# Altium schematic sheet 03_PWR.SchDoc
size A3; SheetNumber: 2; SheetTotal: 16
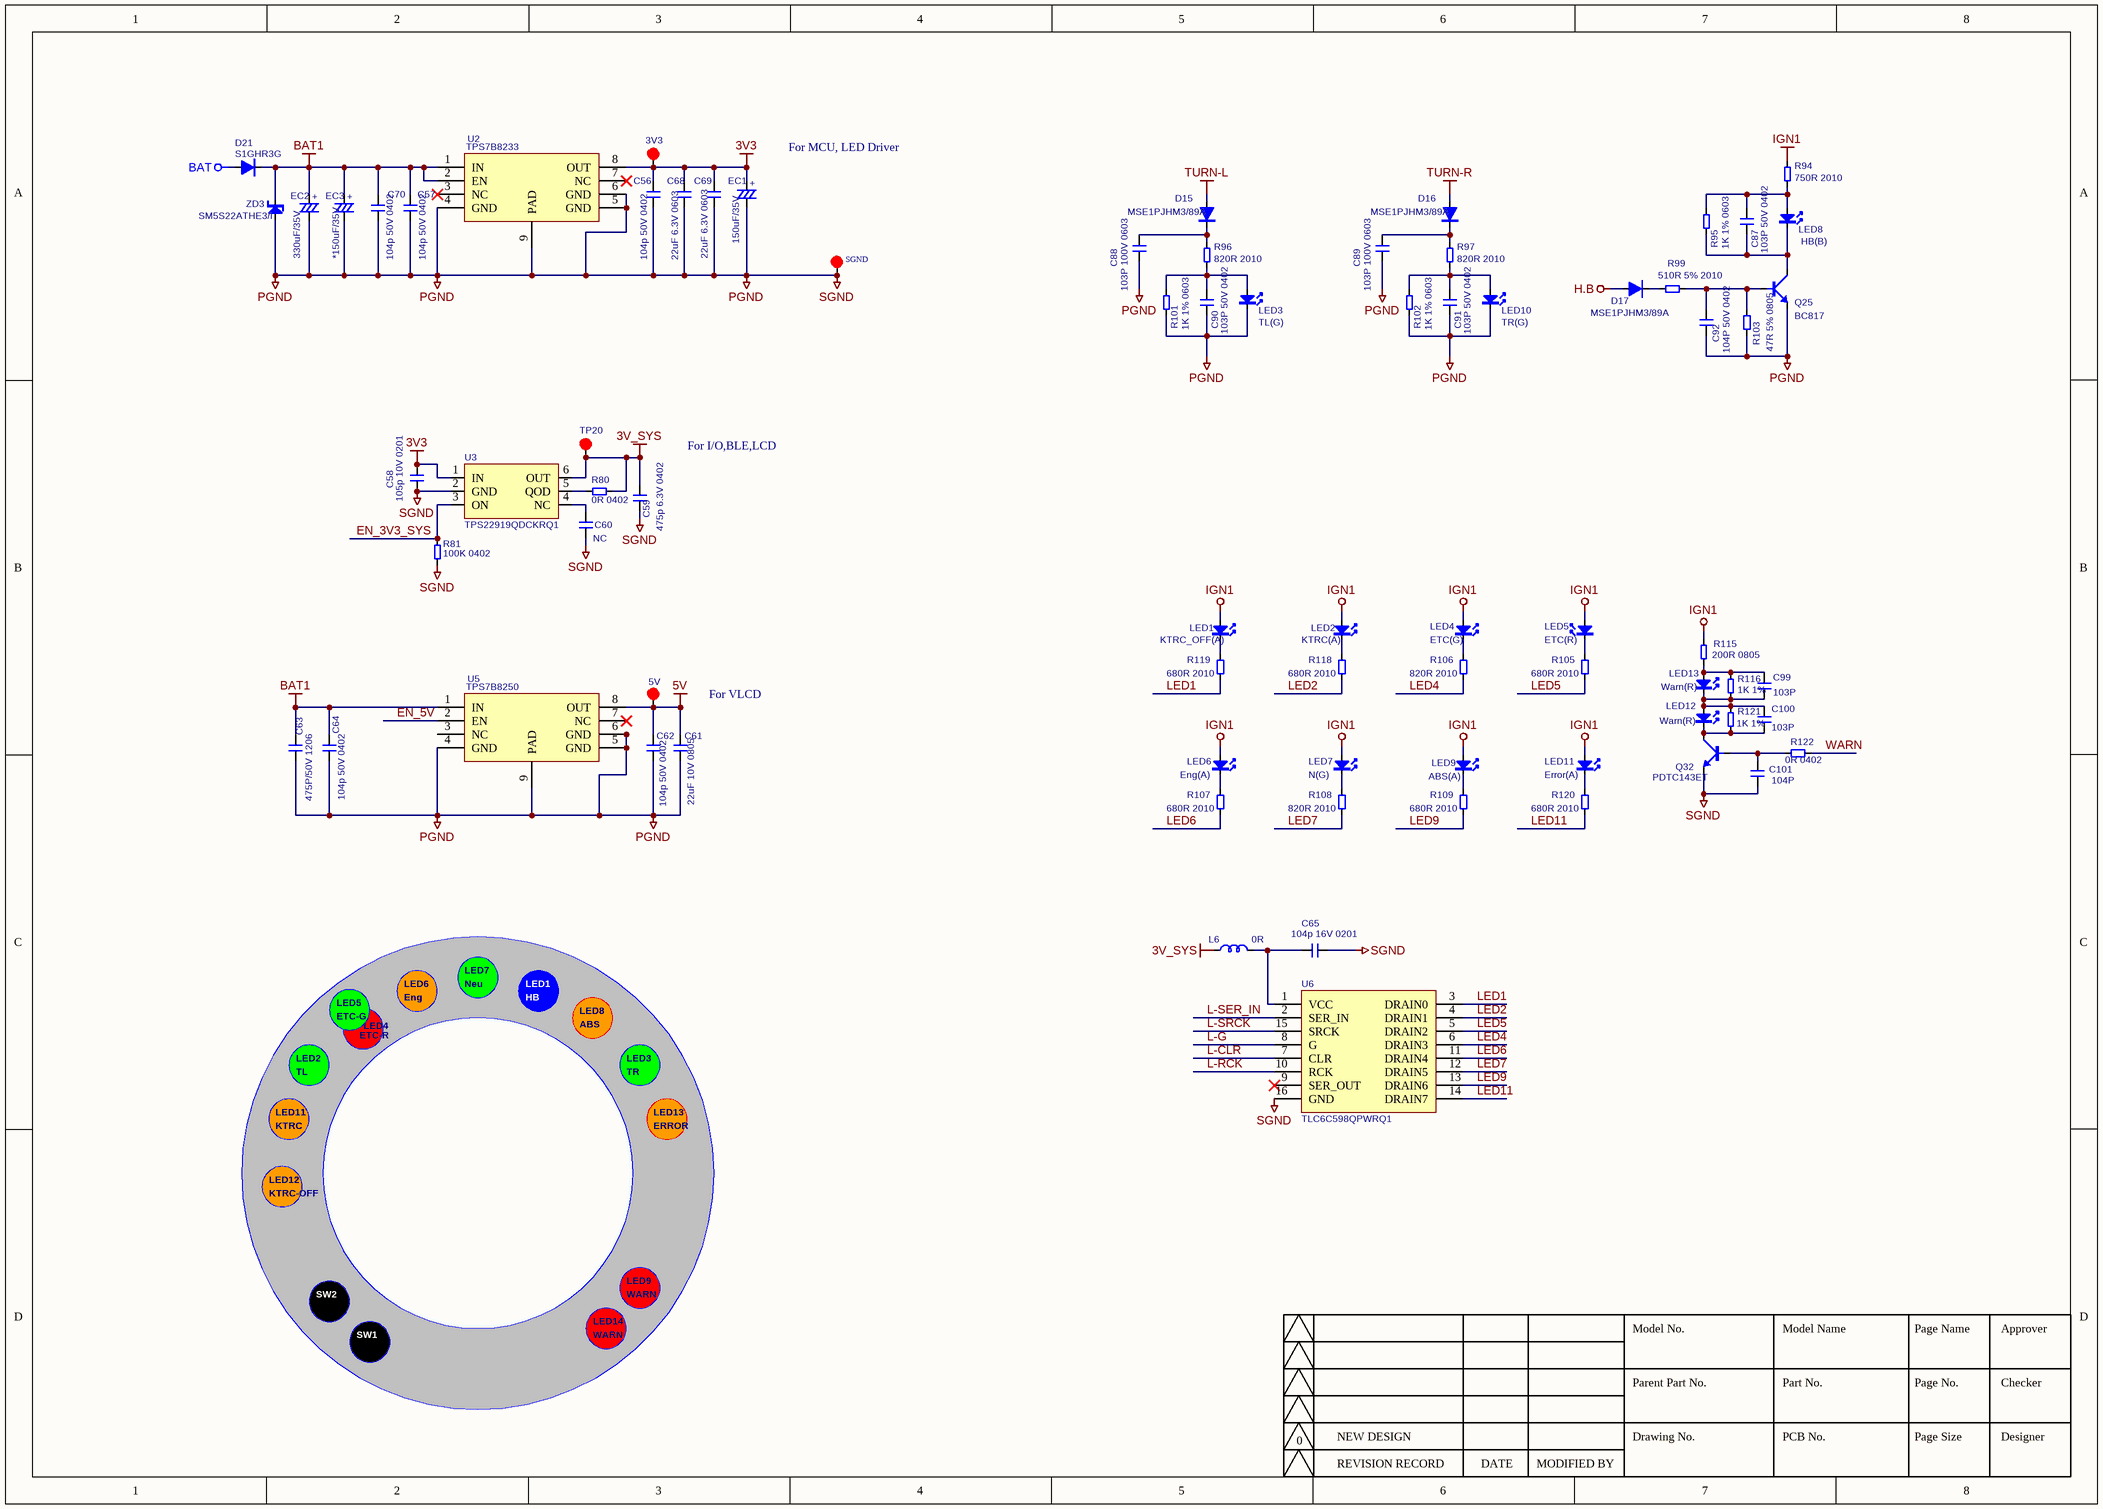
[diagram p0: 03_PWR.SchDoc]

## Parts
3V3  TEST  [TEST]  (value not drawn)
5V  TEST  [TEST]  (value not drawn)
C56  104p 50V 0402  [C0402]
C57  104p 50V 0402  [C0402]
C58  105p 10V 0201  [C0201]
C59  475p 6.3V 0402  [C0402]
C60  NC  [C0402]
C61  22uF 10V 0805  [C0805]
C62  104p 50V 0402  [C0402]
C63  475P/50V 1206  [C1206]
C64  104p 50V 0402  [C0402]
C65  104p 16V 0201  [C0201]
C68  22uF 6.3V 0603  [C0603]
C69  22uF 6.3V 0603  [C0603]
C70  104p 50V 0402  [C0402]
C87  103P 50V 0402  [C0402]
C88  103P 100V 0603  [C0603]
C89  103P 100V 0603  [C0603]
C90  103P 50V 0402  [C0402]
C91  103P 50V 0402  [C0402]
C92  104P 50V 0402  [C0402]
C99  103P  [C0402]
C100  103P  [C0402]
C101  104P  [C0402]
D15  MSE1PJHM3/89A  [D-DO-219AD]
D16  MSE1PJHM3/89A  [D-DO-219AD]
D17  MSE1PJHM3/89A  [D-DO-219AD]
D21  S1GHR3G  [D-SMA]
EC1  150uF/35V  [EC-[6.8*8]]
EC2  330uF/35V  [EC-[8.5*10]]
EC3  *150uF/35V  [EC-[6.8*8]]
L6  0R  [0603]
LED1  KTRC_OFF(A)  [LED-1206]
LED2  KTRC(A)  [LED-1206]
LED3  TL(G)  [LED-1206]
LED4  ETC(G)  [LED-1206]
LED5  ETC(R)  [LED-1206]
LED6  Eng(A)  [LED-1206]
LED7  N(G)  [LED-1206]
LED8  HB(B)  [LED-1206]
LED9  ABS(A)  [LED-1206]
LED10  TR(G)  [LED-1206]
LED11  Error(A)  [LED-1206]
LED12  Warn(R)  [LED-1206]
LED13  Warn(R)  [LED-1206]
Q25  BC817  [SOT23-RF]
Q32  PDTC143ET  [SOT23-RF]
R80  0R 0402  [0402]
R81  100K 0402  [0402]
R94  750R 2010  [2010]
R95  1K 1% 0603  [0603]
R96  820R 2010  [2010]
R97  820R 2010  [2010]
R99  510R 5% 2010  [2010]
R101  1K 1% 0603  [0603]
R102  1K 1% 0603  [0603]
R103  47R 5% 0805  [0805]
R105  680R 2010  [2010]
R106  820R 2010  [2010]
R107  680R 2010  [2010]
R108  820R 2010  [2010]
R109  680R 2010  [2010]
R115  200R 0805  [0805]
R116  1K 1%  [0603]
R118  680R 2010  [2010]
R119  680R 2010  [2010]
R120  680R 2010  [2010]
R121  1K 1%  [0603]
R122  0R 0402  [0402]
SGND  TEST  [TEST]  (value not drawn)
TP20  TEST  [TEST]  (value not drawn)
U2  TPS7B8233  [IC-MSOP8(3*3mm)]
U3  TPS22919QDCKRQ1  [IC-R-PDSO-G6]
U5  TPS7B8250  [IC-MSOP8(3*3mm)]
U6  TLC6C598QPWRQ1  [IC-TSSOP16]
ZD3  SM5S22ATHE3/I  [ZD-DO218AB]

## Nets
3V3: 3V3.TP C56.1 C58.2 C68.1 C69.1 EC1.1 U2.8(OUT) U3.1(IN)
3V_SYS: C59.1 L6.1 R80.2 TP20.TP U3.6(OUT)
5V: 5V.TP C61.1 C62.1 U5.8(OUT)
BAT: D21.1(A)
BAT1: C57.1 C63.1 C64.1 C70.1 D21.2(K) EC2.1 EC3.1 U2.1(IN) U2.2(EN) U5.1(IN) ZD3.2(K)
H.B: D17.1(A)
IGN1: LED1.A LED2.A LED4.A LED5.A LED6.A LED7.A LED9.A LED11.A R94.1 R115.2
PGND: C56.2 C57.2 C58.1 C59.2 C60.1 C61.2 C62.2 C63.2 C64.2 C65.2 C68.2 C69.2 C70.2 C88.2 C89.2 C90.2 C91.2 C92.2 C101.2 EC1.2 EC2.2 EC3.2 LED3.K LED10.K Q25.3(E) Q32.3(E) R81.2 R101.2 R102.2 R103.2 SGND.TP U2.4(GND) U2.5(GND) U2.6(GND) U2.9(PAD) U3.2(GND) U5.4(GND) U5.5(GND) U5.6(GND) U5.9(PAD) U6.16(GND) ZD3.1(A)  [also labelled SGND]
TURN-L: D15.1(A)
TURN-R: D16.1(A)
EN_3V3_SYS: R81.1 U3.3(ON)
EN_5V: U5.2(EN)
L-CLR: U6.7(CLR)
L-G: U6.8(G)
L-RCK: U6.10(RCK)
L-SER_IN: U6.2(SER_IN)
L-SRCK: U6.15(SRCK)
LED1: R119.1 U6.3(DRAIN0)
LED2: R118.1 U6.4(DRAIN1)
LED4: R106.1 U6.6(DRAIN3)
LED5: R105.1 U6.5(DRAIN2)
LED6: R107.1 U6.11(DRAIN4)
LED7: R108.1 U6.12(DRAIN5)
LED9: R109.1 U6.13(DRAIN6)
LED11: R120.1 U6.14(DRAIN7)
WARN: R122.1
NetC60_2: C60.2 U3.4(NC)
NetC65_1: C65.1 L6.2 U6.1(VCC)
NetC87_1: C87.1 LED8.A R94.2 R95.1
NetC87_2: C87.2 LED8.K Q25.2(C) R95.2
NetC88_1: C88.1 D15.2(K) R96.1
NetC89_1: C89.1 D16.2(K) R97.1
NetC90_1: C90.1 LED3.A R96.2 R101.1
NetC91_1: C91.1 LED10.A R97.2 R102.1
NetC92_1: C92.1 Q25.1(B) R99.2 R103.1
NetC99_1: C99.1 LED13.A R115.1 R116.1
NetC99_2: C99.2 C100.1 LED12.A LED13.K R116.2 R121.1
NetC100_2: C100.2 LED12.K Q32.2(C) R121.2
NetC101_1: C101.1 Q32.1(B) R122.2
NetD17_2: D17.2(K) R99.1
NetLED1_K: LED1.K R119.2
NetLED2_K: LED2.K R118.2
NetLED4_K: LED4.K R106.2
NetLED5_K: LED5.K R105.2
NetLED6_K: LED6.K R107.2
NetLED7_K: LED7.K R108.2
NetLED9_K: LED9.K R109.2
NetLED11_K: LED11.K R120.2
NetR80_1: R80.1 U3.5(QOD)

Not connected (* = marked no-connect by the designer): U2 3(NC)* 7(NC)*; U5 3(NC) 7(NC)*; U6 9(SER_OUT)*

## Notes on the sheet
- For MCU, LED Driver
- For I/O,BLE,LCD
- For VLCD
- LED6
- LED7
- Neu
- LED1
- LED5
- ETC-G
- ETC-R
- LED4
- Eng
- HB
- LED8
- ABS
- LED11
- KTRC
- LED2
- TL
- LED3
- TR
- LED13
- ERROR
- LED12
- KTRC-OFF
- SW2
- LED14
- LED9
- WARN
- SW1
- Model No.
- Parent Part No.
- Part No.
- Model Name
- Page Name
- Page No.
- Approver
- Checker
- 0
- NEW DESIGN
- Drawing No.
- PCB No.
- Page Size
- Designer
- REVISION RECORD
- DATE
- MODIFIED BY
- (in symbol C-EC) +

## Library data of the parts
C56 C57 C62 C64 C70 = C: Capacitor; z02-包裝or系列名稱: 0603，0805，1206，DIP; z01-耐壓or瓦特數: 16V，25V，50V，100V; z03-誤差: B，C，D，F，G，J，K，M，Z; z05-廠牌: MURATA，TDK; z04-參數: NPO，COG，X7R，Y5V; A-TOP: V31-A1104200; 01-範例: 容值 耐壓 包裝 誤差 參數; z99-略1~101P: 50V 0603 J NP0(C0G) 廠牌; z99-略102P~104P↑: 50V 0603 K X7R  廠牌; z00-值or編碼: *P
C58 = C: Capacitor; z02-包裝or系列名稱: 0603，0805，1206，DIP; z01-耐壓or瓦特數: 16V，25V，50V，100V; z03-誤差: B，C，D，F，G，J，K，M，Z; z05-廠牌: MURATA，TDK; z04-參數: NPO，COG，X7R，Y5V; A-TOP: V31-A1105100; 01-範例: 容值 耐壓 包裝 誤差 參數; z99-略1~101P: 50V 0603 J NP0(C0G) 廠牌; z99-略102P~104P↑: 50V 0603 K X7R  廠牌; z00-值or編碼: *P
C59 = C: 4.7uF 6.3V 0402; z02-包裝or系列名稱: 0603; z03-誤差: B，C，D，F，G，J，K，M，Z; z05-廠牌: MURATA; z04-參數: X7R; A-TOP: V31-A1475201; z99-略1~101P: 50V 0603 J NP0(C0G) 廠牌; z99-略102P~104P↑: 50V 0603 K X7R  廠牌; z01-耐壓or瓦特數: 6.3V; Voltage: 6.3V; Value: 4.7uF
C60 = C: Capacitor; z02-包裝or系列名稱: 0603，0805，1206，DIP; z01-耐壓or瓦特數: 16V，25V，50V，100V; z03-誤差: B，C，D，F，G，J，K，M，Z; z05-廠牌: MURATA，TDK; z04-參數: NPO，COG，X7R，Y5V; 01-範例: 容值 耐壓 包裝 誤差 參數; z99-略1~101P: 50V 0603 J NP0(C0G) 廠牌; z99-略102P~104P↑: 50V 0603 K X7R  廠牌; z00-值or編碼: *P; A-TOP: NC
C61 = C: Capacitor; z02-包裝or系列名稱: 0603，0805，1206，DIP; z01-耐壓or瓦特數: 16V，25V，50V，100V; z03-誤差: B，C，D，F，G，J，K，M，Z; z05-廠牌: MURATA，TDK; z04-參數: NPO，COG，X7R，Y5V; A-TOP: V31-01226402; 01-範例: 容值 耐壓 包裝 誤差 參數; z99-略1~101P: 50V 0603 J NP0(C0G) 廠牌; z99-略102P~104P↑: 50V 0603 K X7R  廠牌; z00-值or編碼: *P
C63 = C: Capacitor; z02-包裝or系列名稱: 0603，0805，1206，DIP; z01-耐壓or瓦特數: 16V，25V，50V，100V; z03-誤差: B，C，D，F，G，J，K，M，Z; z05-廠牌: MURATA，TDK; z04-參數: NPO，COG，X7R，Y5V; A-TOP: 475P 1206; 01-範例: 容值 耐壓 包裝 誤差 參數; z99-略1~101P: 50V 0603 J NP0(C0G) 廠牌; z99-略102P~104P↑: 50V 0603 K X7R  廠牌; z00-值or編碼: *P
C65 = C: Capacitor; z02-包裝or系列名稱: 0603，0805，1206，DIP; z01-耐壓or瓦特數: 16V，25V，50V，100V; z03-誤差: B，C，D，F，G，J，K，M，Z; z05-廠牌: MURATA，TDK; z04-參數: NPO，COG，X7R，Y5V; A-TOP: V31-A1104100; 01-範例: 容值 耐壓 包裝 誤差 參數; z99-略1~101P: 50V 0603 J NP0(C0G) 廠牌; z99-略102P~104P↑: 50V 0603 K X7R  廠牌; z00-值or編碼: *P
C68 C69 = C: Capacitor; z02-包裝or系列名稱: 0603，0805，1206，DIP; z01-耐壓or瓦特數: 16V，25V，50V，100V; z03-誤差: B，C，D，F，G，J，K，M，Z; z05-廠牌: MURATA，TDK; z04-參數: NPO，COG，X7R，Y5V; A-TOP: V31-A1226300; 01-範例: 容值 耐壓 包裝 誤差 參數; z99-略1~101P: 50V 0603 J NP0(C0G) 廠牌; z99-略102P~104P↑: 50V 0603 K X7R  廠牌; z00-值or編碼: *P
C87 C90 C91 C99 C100 = C: Capacitor; z02-包裝or系列名稱: 0603，0805，1206，DIP; z01-耐壓or瓦特數: 16V，25V，50V，100V; z03-誤差: B，C，D，F，G，J，K，M，Z; z05-廠牌: MURATA，TDK; z04-參數: NPO，COG，X7R，Y5V; A-TOP: 103P 0402; 01-範例: 容值 耐壓 包裝 誤差 參數; z99-略1~101P: 50V 0603 J NP0(C0G) 廠牌; z99-略102P~104P↑: 50V 0603 K X7R  廠牌; z00-值or編碼: *P
C88 C89 = C: Capacitor; z02-包裝or系列名稱: 0603，0805，1206，DIP; z01-耐壓or瓦特數: 16V，25V，50V，100V; z03-誤差: B，C，D，F，G，J，K，M，Z; z05-廠牌: MURATA，TDK; z04-參數: NPO，COG，X7R，Y5V; A-TOP: V31-01103300; 01-範例: 容值 耐壓 包裝 誤差 參數; z99-略1~101P: 50V 0603 J NP0(C0G) 廠牌; z99-略102P~104P↑: 50V 0603 K X7R  廠牌; z00-值or編碼: *P
C92 C101 = C: Capacitor; z02-包裝or系列名稱: 0603，0805，1206，DIP; z01-耐壓or瓦特數: 16V，25V，50V，100V; z03-誤差: B，C，D，F，G，J，K，M，Z; z05-廠牌: MURATA，TDK; z04-參數: NPO，COG，X7R，Y5V; A-TOP: 104P 0402 X5R; 01-範例: 容值 耐壓 包裝 誤差 參數; z99-略1~101P: 50V 0603 J NP0(C0G) 廠牌; z99-略102P~104P↑: 50V 0603 K X7R  廠牌; z00-值or編碼: *P
D15-D17 = D-SMD: SK54-AU/BAS16/RR264/1N4148/FM4004/SS14/SSL14/V15PL50/DO-219AD; z2-包裝: 2F，SOT23，SMA，SMB，SMC，LL34，SOD323，PMDU，SOD123，SOD123FL，SMPC; z0-編號: BAS16，BAV99，RR264，1N4148W，FM4004，V15PL50; 01-範例: 編碼 包裝(SOT23略); A-TOP值參考: VS-1EQH02HM3，SK54-AU，MSE1PJHM3/89A; A-TOP: MSE1PJHM3/89A
D21 = D-SMD: BAS16/RR264/1N4148/FM4004/SS14/SSL14/V15PL50; z2-包裝: SOT23，SMA，SMB，SMC，LL34，SOD323，PMDU，SOD123，SOD123FL，SMPC; z0-編號: BAS16，BAV99，RR264，1N4148，FM4004，SS14，SSL14，V15PL50; A-TOP: S1GHR; 01-範例: 編碼 包裝(SOT23略)
EC1 EC3 = C-EC: 電解電容; z02.1-包裝DIP: 5x11，6x11，8x11，10x16，10x20; z01-耐壓or瓦特數: 16V，25V，50V，100V; z05-廠牌: CAPXON，CHEMI-CON，TEAPO，STONE，LELON，TOSHIN，RUBRCON; z08-腳長or角度: 3mm，15mm; 01-範例DIP: 容值 耐壓 DφxL 腳長=470uF 25V 8x11 15mm; A-TOP: V11-01015000; 02-範例SMD: 容值 耐壓 DφxL(包裝)=220uF 25V 8．5; z02.2-包裝鉭質SMD: B，C，D; z02.3-包裝電解SMD: 4．5(4x5.5)，5．5(5x5.5)，6．8(6.3x8)，8．5(8x10.5)，10．4(10.4x10.4); z99-省略的部份: 廠牌; z04-參數: KM，KF; z00-值or編碼: *uF
EC2 = C-EC: 電解電容; z02.1-包裝DIP: 5x11，6x11，8x11，10x16，10x20; z01-耐壓or瓦特數: 16V，25V，50V，100V; z05-廠牌: CAPXON，CHEMI-CON，TEAPO，STONE，LELON，TOSHIN，RUBRCON; z08-腳長or角度: 3mm，15mm; 01-範例DIP: 容值 耐壓 DφxL 腳長=470uF 25V 8x11 15mm; A-TOP: V11-01033000; 02-範例SMD: 容值 耐壓 DφxL(包裝)=220uF 25V 8．5; z02.2-包裝鉭質SMD: B，C，D; z02.3-包裝電解SMD: 4．5(4x5.5)，5．5(5x5.5)，6．8(6.3x8)，8．5(8x10.5)，10．4(10.4x10.4); z99-省略的部份: 廠牌; z04-參數: KM，KF; z00-值or編碼: *uF
L6 = L: BEAD101; A-TOP: V02-01000030; z01-耐壓or瓦特數: 0603，; 01-範例: 編碼 包裝(0603略); z00-值or編碼: BEAD101; z02.1-包裝DIP: *; z02.2-SMD: *; z04-參數: *; z08-腳長or角度: *
LED1 LED2 LED6 LED9 LED11 = LED: 01-範例SMD: LED 包裝 顏色; A-TOP: LED 3020 A U2V1; 01-範例DIP: LED DIPφ 顏色; z02-包裝: 1206，3020，3527，3528，DIP3，DIP5; z06-顏色: R，G，B，A，O; z08-腳長or角度: 24mm，無限定者 略; z09-客戶專用: SUZUKI，KY; z00-值or編碼: *
LED3 LED4 LED7 LED10 = LED: 01-範例SMD: LED 包裝 顏色; A-TOP: LED 3020 G; 01-範例DIP: LED DIPφ 顏色; z02-包裝: 1206，3020，3527，3528，DIP3，DIP5; z06-顏色: R，G，B，A，O; z08-腳長or角度: 24mm，無限定者 略; z09-客戶專用: SUZUKI，KY; z00-值or編碼: *
LED5 LED12 LED13 = LED: 01-範例SMD: LED 包裝 顏色; A-TOP: LED 3020 R; 01-範例DIP: LED DIPφ 顏色; z02-包裝: 1206，3020，3527，3528，DIP3，DIP5; z06-顏色: R，G，B，A，O; z08-腳長or角度: 24mm，無限定者 略; z09-客戶專用: SUZUKI，KY; z00-值or編碼: *
LED8 = LED: 01-範例SMD: LED 包裝 顏色; A-TOP: LED 3020 B; 01-範例DIP: LED DIPφ 顏色; z02-包裝: 1206，3020，3527，3528，DIP3，DIP5; z06-顏色: R，G，B，A，O; z08-腳長or角度: 24mm，無限定者 略; z09-客戶專用: SUZUKI，KY; z00-值or編碼: *
Q25 = Q-NPN(BCE): BC817，PDTC143ET，2SD2211，2SD1918; z1-包裝: SOT23，SOT89，DPAK; 01-範例: 編號 包裝(SOT23略); z0-編號: BC817，PDTC143ET，2SD2211，2SD1918; A-TOP: BC817
Q32 = Q-NPN(BCE): BC817/PDTC143ET/2SD2211/2SD1918; z0-編號: BC817，PDTC143ET，2SD2211，2SD1918; z1-包裝: SOT23，SOT89，DPAK; 01-範例: 編號 包裝(SOT23略略; A-TOP: PDTC143ET
R80 = R-0603: 0603; z03-誤差: 1％; z05-廠牌: YAGEO，SYNTON，E-COM，WALSIN，EVER; 01-範例: 阻值 包裝(瓦特) 誤差; z99-省略的部份: 5% 廠牌; A-TOP: V02-01000020; z02-包裝or系列名稱: 0603
R81 = R: z02-包裝or系列名稱: 0603，1206，2010，2512，MECF200SS; z01-耐壓or瓦特數: Ｘ; z03-誤差: 5％; z05-廠牌: YAGEO，SYNTON，E-COM，WALSIN，EVER; 01-範例: 阻值 包裝(瓦特) 誤差; A-TOP: V02-02010420; z99-省略的部份: 0805 5% 廠牌; z04-參數: Ｘ
R94 R96 R97 = R: z02-包裝or系列名稱: 0603，1206，2010，2512，MECF200SS; z01-耐壓or瓦特數: Ｘ; z03-誤差: 5％; z05-廠牌: YAGEO，SYNTON，E-COM，WALSIN，EVER; 01-範例: 阻值 包裝(瓦特) 誤差; z99-省略的部份: 0805 5% 廠牌; z04-參數: Ｘ
  R94: A-TOP: 750R 2010
  R96 R97: A-TOP: 820R 2010
R95 R101 R102 R116 R121 = R: z02-包裝or系列名稱: 0603，1206，2010，2512，MECF200SS; z01-耐壓or瓦特數: Ｘ; z03-誤差: 5％; z05-廠牌: YAGEO，SYNTON，E-COM，WALSIN，EVER; 01-範例: 阻值 包裝(瓦特) 誤差; A-TOP: 1K 1% 0603 國; z99-省略的部份: 0805 5% 廠牌; z04-參數: Ｘ
R99 = R: z03-誤差: 1％; z05-廠牌: YAGEO，SYNTON，E-COM，WALSIN，EVER; 01-範例: 阻值 包裝(瓦特) 誤差; z99-省略的部份: 0805 5% 廠牌; z04-參數: Ｘ; A-TOP: 510R 2010; z02-包裝or系列名稱: 0603，1206，2010，2512，MECF200SS; z01-耐壓or瓦特數: Ｘ
R103 = R: z03-誤差: 1％; z05-廠牌: YAGEO，SYNTON，E-COM，WALSIN，EVER; 01-範例: 阻值 包裝(瓦特) 誤差; z99-省略的部份: 0805 5% 廠牌; z04-參數: Ｘ; A-TOP: 47R 0805; z02-包裝or系列名稱: 0603，1206，2010，2512，MECF200SS; z01-耐壓or瓦特數: Ｘ
R105-R109 R118-R120 = R-2010: 2010; z03-誤差: 1％; z05-廠牌: YAGEO，SYNTON，E-COM，WALSIN，EVER; 01-範例: 阻值 包裝(瓦特) 誤差; z99-省略的部份: 5% 廠牌; z02-包裝or系列名稱: 2010
  R105 R107 R109 R118-R120: A-TOP: 680R 2010
  R106 R108: A-TOP: 820R 2010
R115 = R: z02-包裝or系列名稱: 0603，1206，2010，2512，MECF200SS; z01-耐壓or瓦特數: Ｘ; z03-誤差: 1％; z05-廠牌: YAGEO，SYNTON，E-COM，WALSIN，EVER; 01-範例: 阻值 包裝(瓦特) 誤差; A-TOP: V02-20112; z99-省略的部份: 0805 5% 廠牌; z04-參數: Ｘ
R122 = R: z03-誤差: 1％; z05-廠牌: YAGEO，SYNTON，E-COM，WALSIN，EVER; 01-範例: V02-01010320; A-TOP: V02-01000020; z99-省略的部份: 0805 5% 廠牌; z02-包裝or系列名稱: 0603，1206，2010，2512，MECF200SS; z01-耐壓or瓦特數: Ｘ; z04-參數: Ｘ
U2 = IC-TPS7B82-Q1: A-TOP: V07-03TPS7B1
U3 = TPS22919QDCKRQ1: A-TOP: V07-06TPS221
U5 = IC-TPS7B82-Q1: A-TOP: V07-03TPS7B0
U6 = IC-TLC6C598: A-TOP: V07-026C5980
ZD3 = ZENER: z01-耐壓or瓦特數: 1／2W，1W，1．5W; z02-包裝or系列名稱: SMA，SMB，SMC，LL34，SOT23略; z03-誤差: 1％，2％，5％略; A-TOP: SM5S22A DO-218AB; 01-範例: 耐壓 包裝 瓦特數 誤差; z00-值or編碼: ZD：值